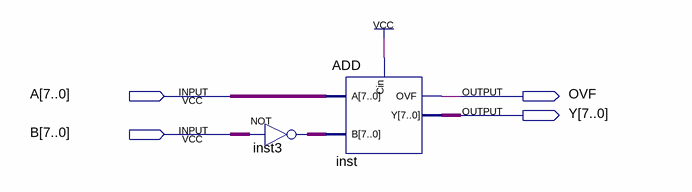
[diagram p0: schematic sheet]
// Quartus schematic SUB.bdf as structural Verilog: 2 symbols, 4 pins
module SUB (
  input  [7:0] A,
  input  [7:0] B,
  output OVF,
  output [7:0] Y
);

  wire [7:0] inst3_out;

  assign inst3_out = ~B;  // NOT inst3, 8 bits wide
  ADD inst (.A(A), .B(inst3_out), .Cin(1'b1), .Y(Y), .OVF(OVF));
endmodule
